# Altium schematic sheet H Bridge.SchDoc
size A; SheetNumber: 1; SheetTotal: 1
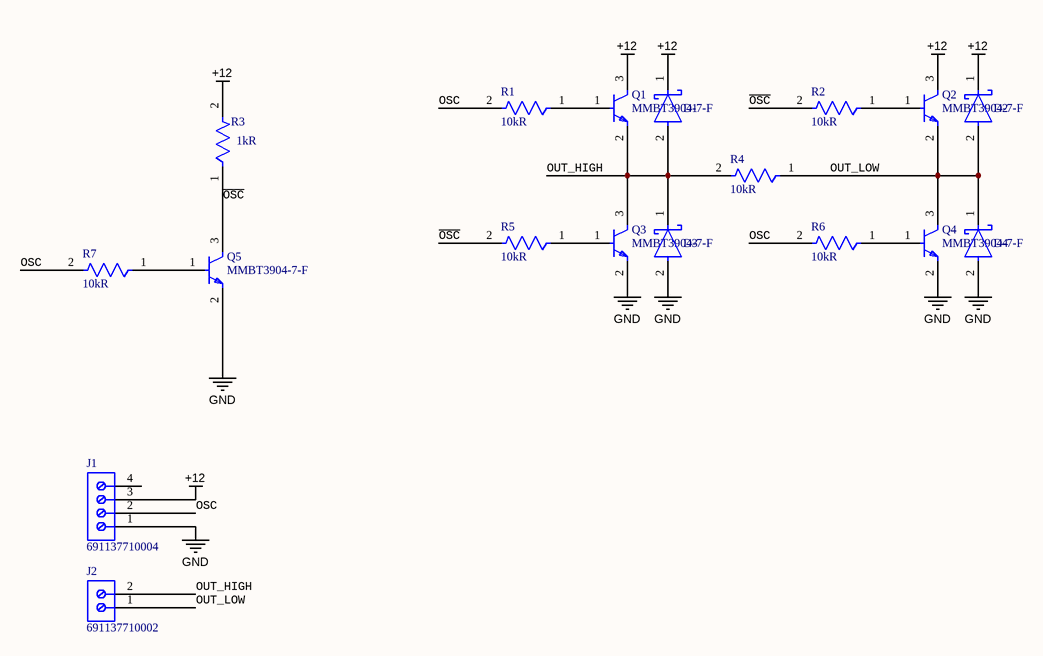
[diagram p0: H Bridge.SchDoc]

## Parts
D1  SK520B  [FP-SMB-MFG]  (value not drawn)
D2  SK520B  [FP-SMB-MFG]  (value not drawn)
D3  SK520B  [FP-SMB-MFG]  (value not drawn)
D4  SK520B  [FP-SMB-MFG]  (value not drawn)
J1  691137710004  [691137710004]
J2  691137710002  [691137710002]
Q1  MMBT3904-7-F  [FP-SOT23-IPC_A]
Q2  MMBT3904-7-F  [FP-SOT23-IPC_A]
Q3  MMBT3904-7-F  [FP-SOT23-IPC_A]
Q4  MMBT3904-7-F  [FP-SOT23-IPC_A]
Q5  MMBT3904-7-F  [FP-SOT23-IPC_A]
R1  Resistance: 10kR  [FP-RR1220-IPC_A]  (hidden comment: RR1220P-103-D)
R2  Resistance: 10kR  [FP-RR1220-IPC_A]  (hidden comment: RR1220P-103-D)
R3  Resistance: 1kR  [FP-RR1220-IPC_A]  (hidden comment: RR1220P-102-D)
R4  Resistance: 10kR  [FP-RR1220-IPC_A]  (hidden comment: RR1220P-103-D)
R5  Resistance: 10kR  [FP-RR1220-IPC_A]  (hidden comment: RR1220P-103-D)
R6  Resistance: 10kR  [FP-RR1220-IPC_A]  (hidden comment: RR1220P-103-D)
R7  Resistance: 10kR  [FP-RR1220-IPC_A]  (hidden comment: RR1220P-103-D)

## Nets
+12: D1.1(C) D2.1(C) J1.3 Q1.3(C) Q2.3(C) R3.2
GND: D3.2(A) D4.2(A) J1.1 Q3.2(E) Q4.2(E) Q5.2(E)
~{OSC}: Q5.3(C) R2.2 R3.1 R5.2
OSC: J1.2 R1.2 R6.2 R7.2
OUT_HIGH: D1.2(A) D3.1(C) J2.2 Q1.2(E) Q3.3(C) R4.2
OUT_LOW: D2.2(A) D4.1(C) J2.1 Q2.2(E) Q4.3(C) R4.1
NetQ1_1: Q1.1(B) R1.1
NetQ2_1: Q2.1(B) R2.1
NetQ3_1: Q3.1(B) R5.1
NetQ4_1: Q4.1(B) R6.1
NetQ5_1: Q5.1(B) R7.1

Not connected (* = marked no-connect by the designer): J1 4

## Library data of the parts
D1-D4 = CMP-10078-124483505-1: SK520B Diode Schottky 200V 5A Smb; Peak Reverse Current: 200nA; Capacitance: 140pF; Max Junction Temperature (Tj): 150°C; Max Forward Surge Current (Ifsm): 110A; Max Repetitive Reverse Voltage (Vrrm): 200V; NexarPartId: 124483505; Case/Package: SMB; Forward Current: 5A; Max Operating Temperature: 150°C; Min Operating Temperature: -55°C; Height: 2.6mm; Reverse Voltage: 200V
J1 = CMP-1502-03326-2: NexarPartId: 78871140; Packaging: Box; RoHS: Non-Compliant; Number of Pins: 4; Lead Pitch: 5mm
J2 = CMP-1502-03324-2: NexarPartId: 78871135; Voltage Rating: 300V; Number of Contacts: 2; Current Rating: 16A; Lead Pitch: 5mm; Height: 11.6mm; Packaging: Box; RoHS: Non-Compliant; Contact Material: Nickel, Tin; Max Operating Temperature: 120°C; Number of Pins: 2; Min Operating Temperature: -30°C; Number of Rows: 1
Q1-Q5 = CMP-2000-04931-2: TRANS NPN 40V 0.2A SMD SOT23-3; Frequency: 300MHz; Power Dissipation: 350mW; Element Configuration: Single; Max Power Dissipation: 300mW; Max Collector Current: 200mA; Collector Emitter Saturation Voltage: 300mV; Number of Elements: 1; hFE Min: 100; Collector Base Voltage (VCBO): 60V; Emitter Base Voltage (VEBO): 6V; Contact Plating: Tin; Package Quantity: 3000; Max Frequency: 300MHz; REACH SVHC: No SVHC; Max Operating Temperature: 150°C; Width: 1.4mm; Collector Emitter Voltage (VCEO): 40V; Voltage Rating (DC): 40V; Radiation Hardening: No; Case/Package: SOT-23; Height: 1mm; Collector Emitter Breakdown Voltage: 40V; Length: 3.05mm; Polarity: NPN; Packaging: Tape and Reel; Number of Pins: 3; Min Operating Temperature: -55°C; Gain Bandwidth Product: 300MHz; Mount: Surface Mount; Weight: 0.000282oz; Continuous Collector Current: 200mA; Transition Frequency: 300MHz; Max Breakdown Voltage: 40V; Lead Free: Lead Free
R1 R2 R4-R7 = CMP-2001-03215-2: 10kΩ ±0.5% 0.1W 1/10W Chip Resistor 0805 (2012 Metric) Thin Film; Max Power Dissipation: 100mW; Voltage Rating: 100V; Temperature Coefficient: 25ppm/°C; Size Code: 0805; RoHS Compliant: Yes; Package Quantity: 1; Resistance Tolerance: 0.5%; Depth: 1.25mm; Lead Free: Lead Free; Series: RR; Min Operating Temperature: -55°C; Weight: 0.000194oz; Width: 1.25mm; Packaging: Tape and Reel; Termination: SMD/SMT; Length: 2mm; Power Rating: 100mW; Case Code (Metric): 2012; Resistor Type: Thin Film; Height: 0.4mm; Case/Package: 0805; Case Code (Imperial): 0805; Technology: THIN FILM; Max Operating Temperature: 125°C; Voltage Rating (DC): 100V; Number of Terminations: 2; Tolerance: 0.5%
R3 = CMP-2001-03210-2: 1kΩ ±0.5% 0.1W 1/10W Chip Resistor 0805 (2012 Metric) Thin Film; Voltage Rating (DC): 100V; Temperature Coefficient: 25ppm/°C; Power Rating: 100mW; Packaging: Tape and Reel; Max Operating Temperature: 125°C; Resistor Type: Thin Film; Length: 2mm; Number of Terminations: 2; Resistance Tolerance: 0.5%; Termination: SMD/SMT; Height: 0.4mm; Max Power Dissipation: 100mW; Lead Free: Lead Free; Min Operating Temperature: -55°C; Size Code: 0805; Voltage Rating: 100V; Package Quantity: 1; Width: 1.25mm; Depth: 1.25mm; Case/Package: 0805; Case Code (Imperial): 0805; Case Code (Metric): 2012; Tolerance: 0.5%; Series: RR; RoHS Compliant: Yes; Technology: THIN FILM